# EAGLE design Printrboard-Pi-Link (EAGLE 7.1.0)
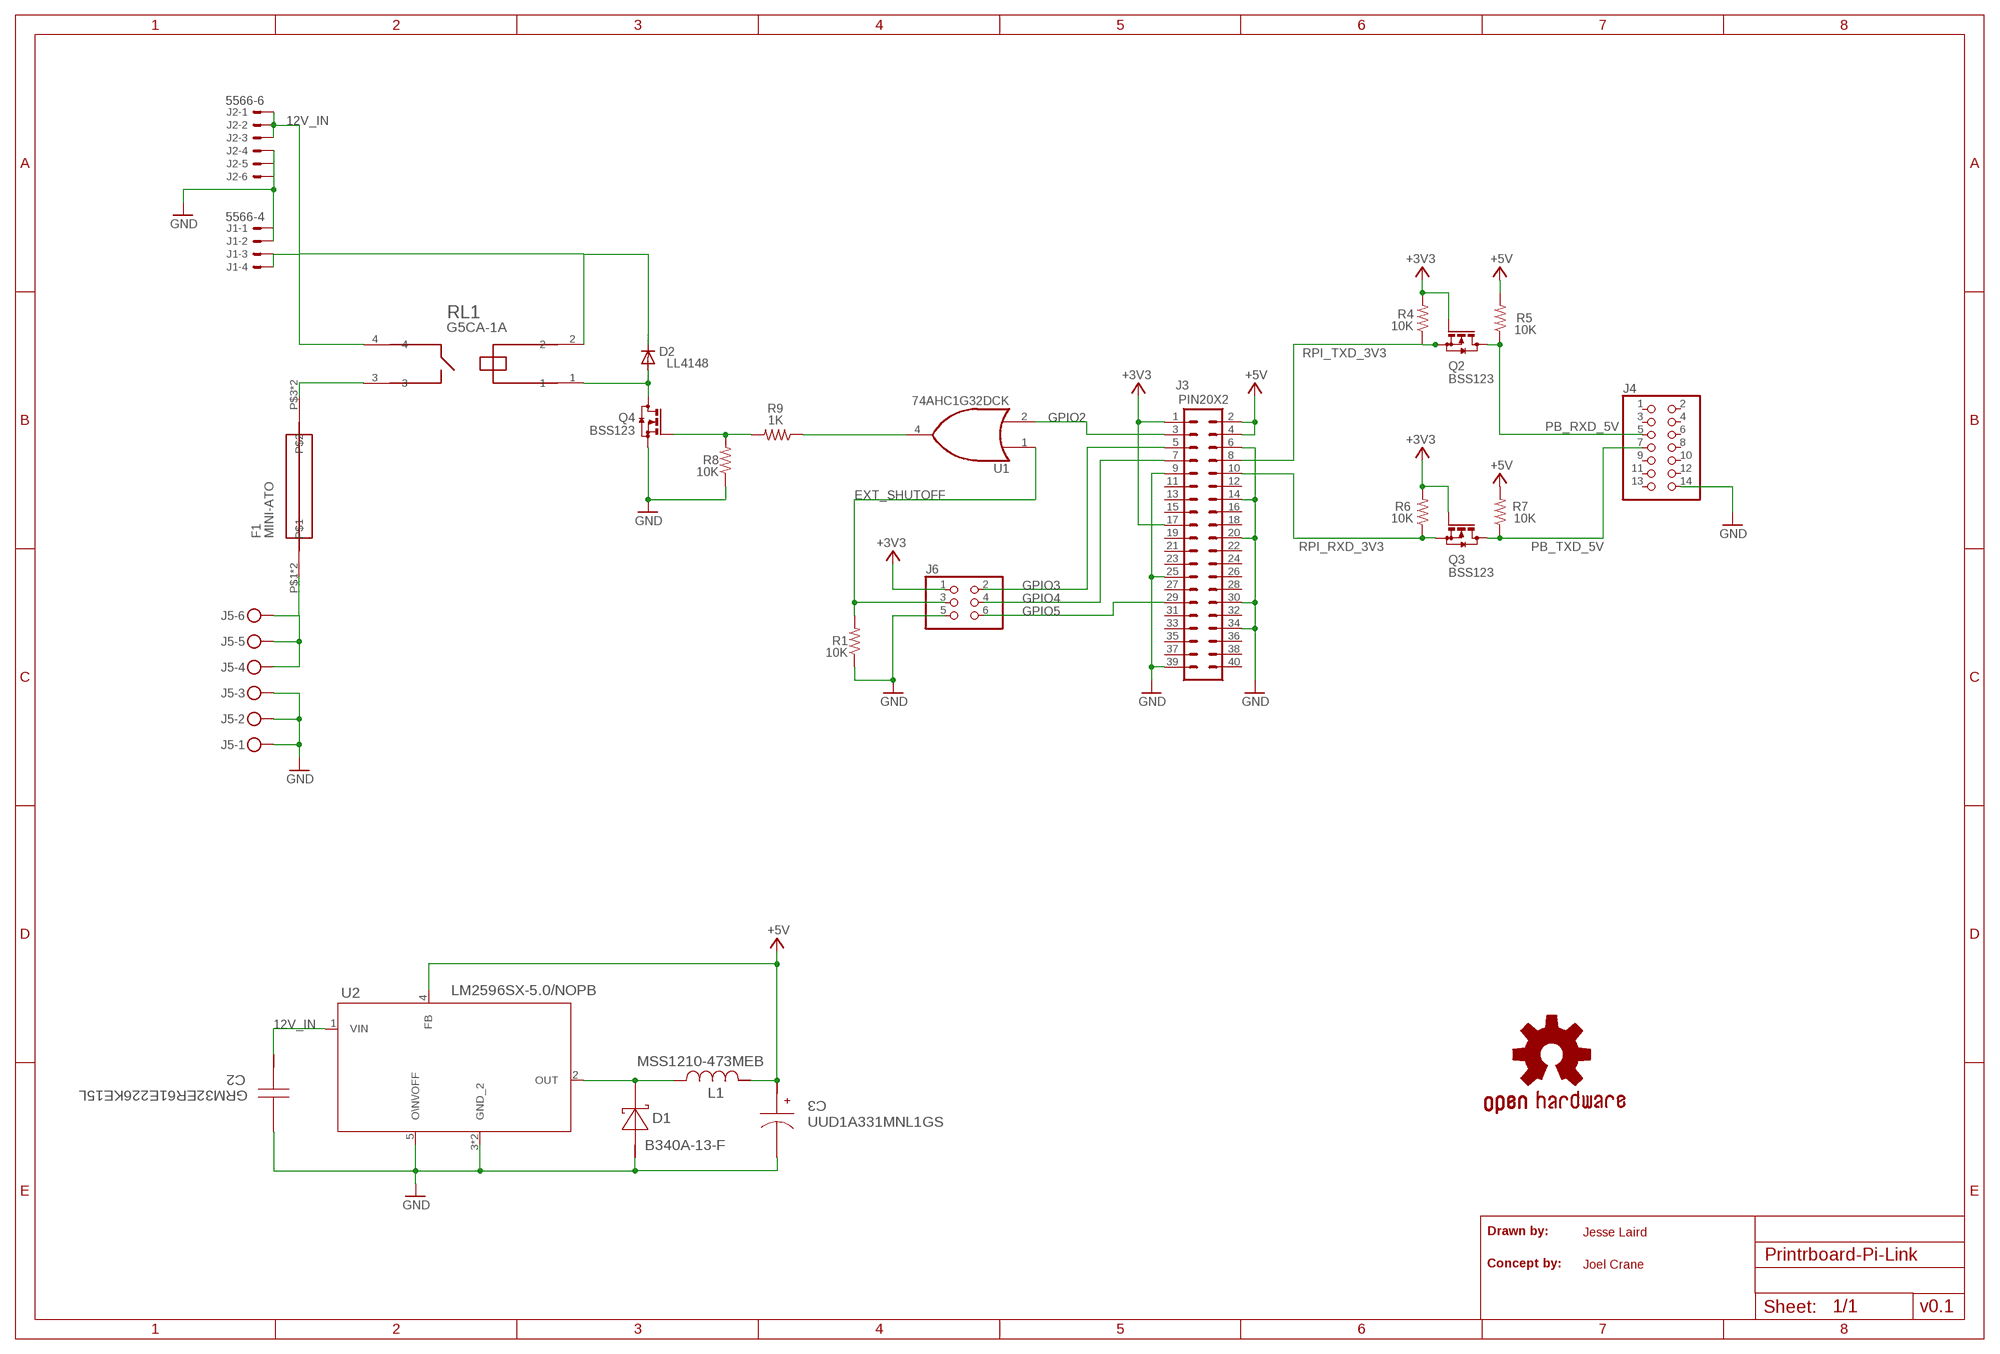
[diagram p0: schematic, sheet 1]

## Parts
C2  GRM32ER61E226KE15L  [1210]
C3  UUD1A331MNL1GS  [SM_RADIAL_8MM]
D1  B340A-13-F  [SMA]
D2  LL4148  PMLL4150  [SOD80C]
F1  MINI-ATO  [BK-6011]
GOLD_ORB_SM1  OSHWLOGO_GOLD_ORB_SM  [OSHW2]
J1  5566-4  [5566-4]
J2  5566-6  [5566-6]
J3  PIN20X2  [PIN_20X2]
J4  PINHD-2X7  [2X07]
J5  MKDSN1,5/6-5,08  [MKDSN1,5/6-5,08]
J6  PINHD-2X3  [2X03]
L1  MSS1210-473MEB  [MSS1210]
Q2  BSS123  [SOT23]
Q3  BSS123  [SOT23]
Q4  BSS123  [SOT23]
R1  10K  R-US_R0603  [R0603]
R4  10K  R-US_R0603  [R0603]
R5  10K  R-US_R0603  [R0603]
R6  10K  R-US_R0603  [R0603]
R7  10K  R-US_R0603  [R0603]
R8  10K  R-US_R0603  [R0603]
R9  1K  R-US_R0603  [R0603]
RL1  G5CA-1A  [G5CA]
U1  74AHC1G32DCK  [SC70-5]
U2  LM2596SX-5.0/NOPB  [TS5B]

## Nets
12V_IN: C2.1 D2.C J1.3 J1.4 J2.1 J2.2 J2.3 RL1.2 RL1.4 U2.1(VIN)
+3V3: J3.1 J3.17 J6.1 Q2.1(G) Q3.1(G) R4.2 R6.2
+5V: C3.1(+) J3.2 J3.4 L1.2 R5.2 R7.2 U2.4(FB)
EXT_SHUTOFF: J6.3 R1.2 U1.1(I0)
GND: C2.2 C3.2(-) D1.2(A) J1.1 J1.2 J2.4 J2.5 J2.6 J3.6 J3.9 J3.14 J3.20 J3.25 J3.30 J3.34 J3.39 J4.14 J5.1 J5.2 J5.3 J6.5 Q4.2(S) R1.1 R8.1 U2.3(GND_2) U2.5(O\N\/OFF) U2.6(GND_2)
GPIO2: J3.3 U1.2(I1)
GPIO3: J3.5 J6.2
GPIO4: J3.7 J6.4
GPIO5: J3.29 J6.6
N$2: F1.P$3 F1.P$4 RL1.3
N$3: R9.1 U1.4(O)
N$4: D1.1(K) L1.1 U2.2(OUT)
N$6: D2.A Q4.3(D) RL1.1
N$7: Q4.1(G) R8.2 R9.2
N$8: F1.P$1 F1.P$2 J5.4 J5.5 J5.6
PB_RXD_5V: J4.5 Q2.3(D) R5.1
PB_TXD_5V: J4.7 Q3.3(D) R7.1
RPI_RXD_3V3: J3.10 Q3.2(S) R6.1
RPI_TXD_3V3: J3.8 Q2.2(S) R4.1
Unconnected: J3.11 J3.12 J3.13 J3.15 J3.16 J3.18 J3.19 J3.21 J3.22 J3.23 J3.24 J3.26 J3.27 J3.28 J3.31 J3.32 J3.33 J3.35 J3.36 J3.37 J3.38 J3.40 J4.1 J4.2 J4.3 J4.4 J4.6 J4.8 J4.9 J4.10 J4.11 J4.12 J4.13

## Notes on the sheet
- Drawn by: | Jesse Laird
- Concept by: | Joel Crane
- v0.1

## Power pins joined to a net without a drawn wire
GND: U1.3(GND)
VCC: U1.5(VCC)

## Library data of the parts
C2 = jesse_laird:GRM32ER61E226KE15L; CAP: 2.2E-5; ESR: 0.0020; IRMS: 0.0; MANUFACTURER_NAME: MuRata; MANUFACTURER_PART_NUMBER: GRM32ER61E226KE15L; VDC: 25.0; VENDOR: MuRata
C3 = jesse_laird:UUD1A331MNL1GS; CAP: 3.3E-4; ESR: 0.17; IRMS: 0.45; MANUFACTURER_NAME: Nichicon; MANUFACTURER_PART_NUMBER: UUD1A331MNL1GS; VDC: 10.0; VENDOR: Nichicon
D1 = jesse_laird:B340A-13-F; DATASHEETURL: http://www.diodes.com/datasheets/ds30891.pdf; IO: 3.0; MANUFACTURER_NAME: Diodes Inc.; MANUFACTURER_PART_NUMBER: B340A-13-F; VENDOR: Diodes Inc.; VFATIO: 0.5; VRRM: 40.0
D2 = diode:PMLL4150: DIODE high speed
F1 = jesse_laird:MINI-ATO
GOLD_ORB_SM1 = bfl:OSHWLOGO: These are Open-Source Hardware logos.
J1 = con-molex:5566-4: Mini FIT connector 4 pol Source: http://www.molex.com; OC_FARNELL: unknown; OC_NEWARK: unknown
J2 = con-molex:5566-6: Mini FIT connector 6 pol Source: http://www.molex.com; MPN: 95566-61002; OC_FARNELL: unknown; OC_NEWARK: 22K8620
J3 = FLYFISH:PIN20X2
J4 = pinhead:PINHD-2X7: PIN HEADER
J5 = con-phoenix-508:MKDSN1,5/6-5,08: MKDSN 1,5/ 6-5,08 Printklemme Nennstrom: 13,5 A Nennspannung: 250 V Rastermaß: 5,08 mm Polzahl: 6 Anschlussart: Schraubanschluss Montage: Löten Anschlussrichtung Leiter/Platine: 0 ° Artikelnummer: 1729160 Source: http://eshop.phoenixcontact.com .. 1729160.pdf
J6 = pinhead:PINHD-2X3: PIN HEADER
L1 = jesse_laird:MSS1210-473MEB; DATASHEETURL: http://www.coilcraft.com/pdfs/mss1210.pdf; DCR: 0.051; DESCRIPTION: Unknown; IDC: 4.6; L: 4.7E-5; MANUFACTURER: CoilCraft; MANUFACTURER_NAME: Coilcraft; MANUFACTURER_PART_NUMBER: MSS1210-473MEB; PACKAGE_DESIGNATOR: MSS1210; VENDOR: Coilcraft
Q2-Q4 = transistor-small-signal:BSS123: N-CHANNEL MOS FET
R1 R4-R9 = resistor:R-US_: RESISTOR, American symbol
RL1 = jesse_laird:G5CA-1A
U1 = 74xx-little-us:74*1G32: 2-input OR gate
U2 = jesse_laird:LM2596SX-5.0/NOPB; DATASHEETURL: http://www.ti.com/product/lm2596; FREQUENCY: 150000.0; IMAX: 3.0; MANUFACTURER_NAME: Texas Instruments; MANUFACTURER_PART_NUMBER: LM2596SX-5.0/NOPB; MKTG_PACKAGE: NA; NSID: LM2596T-ADJ/NOPB; PACKAGE: NA; VENDOR: Texas Instruments

## Board
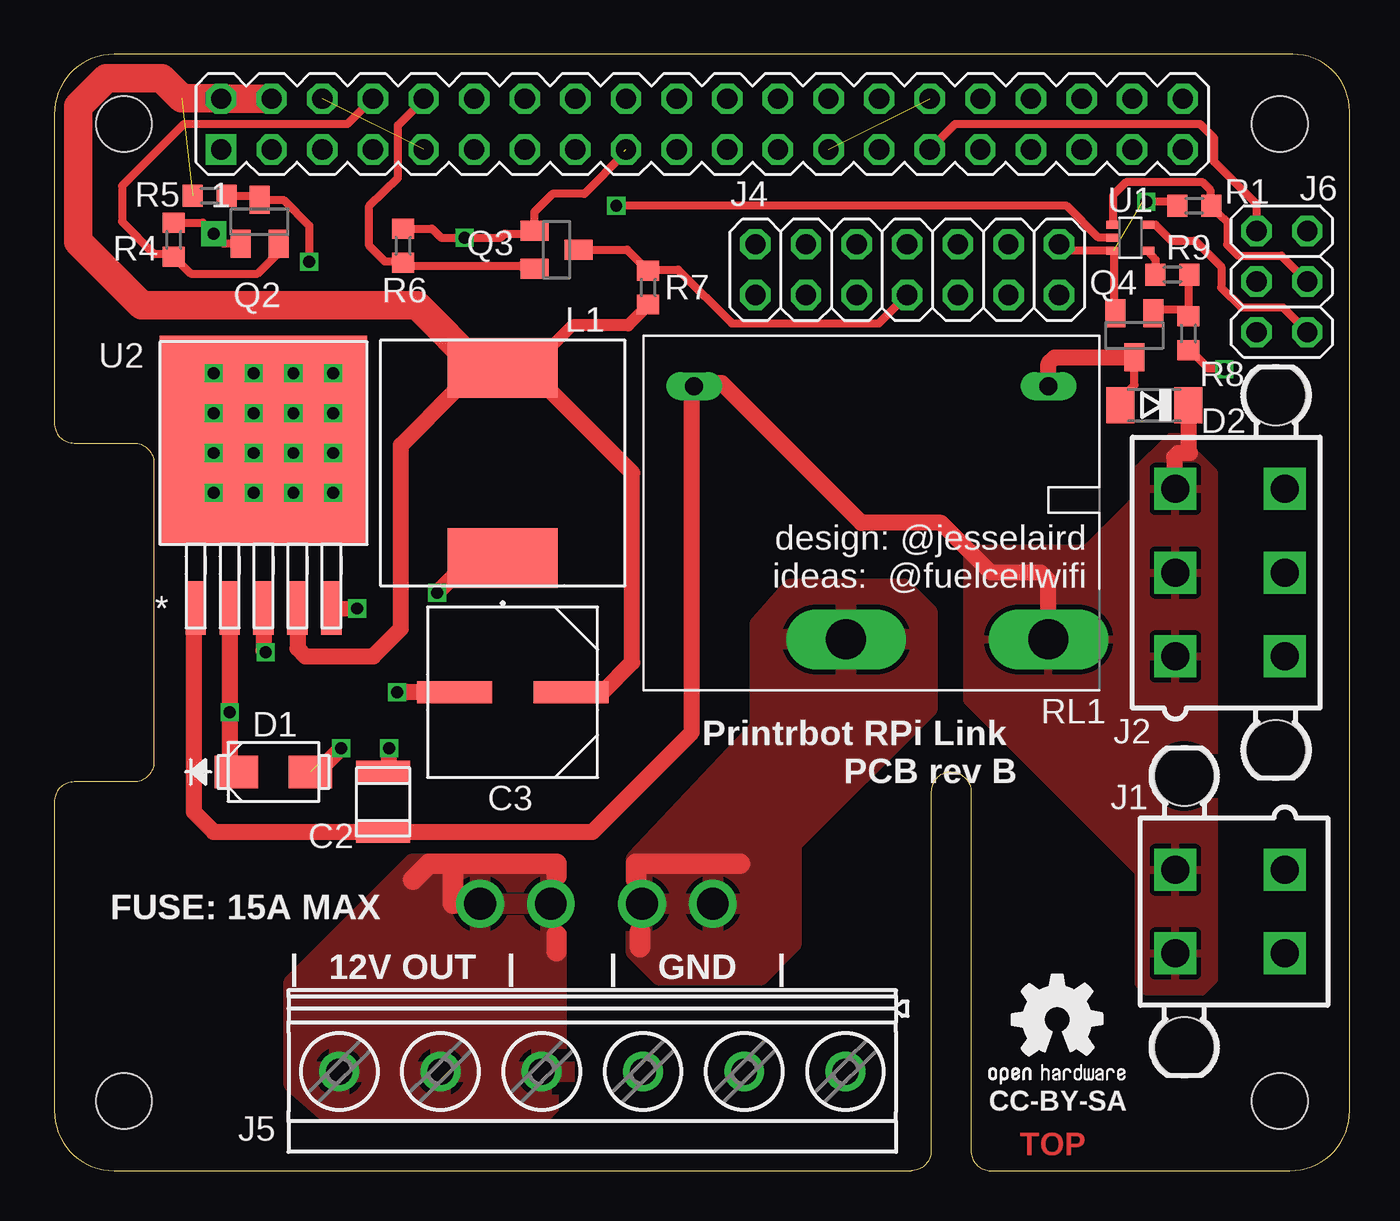
[diagram p1: board, top side]
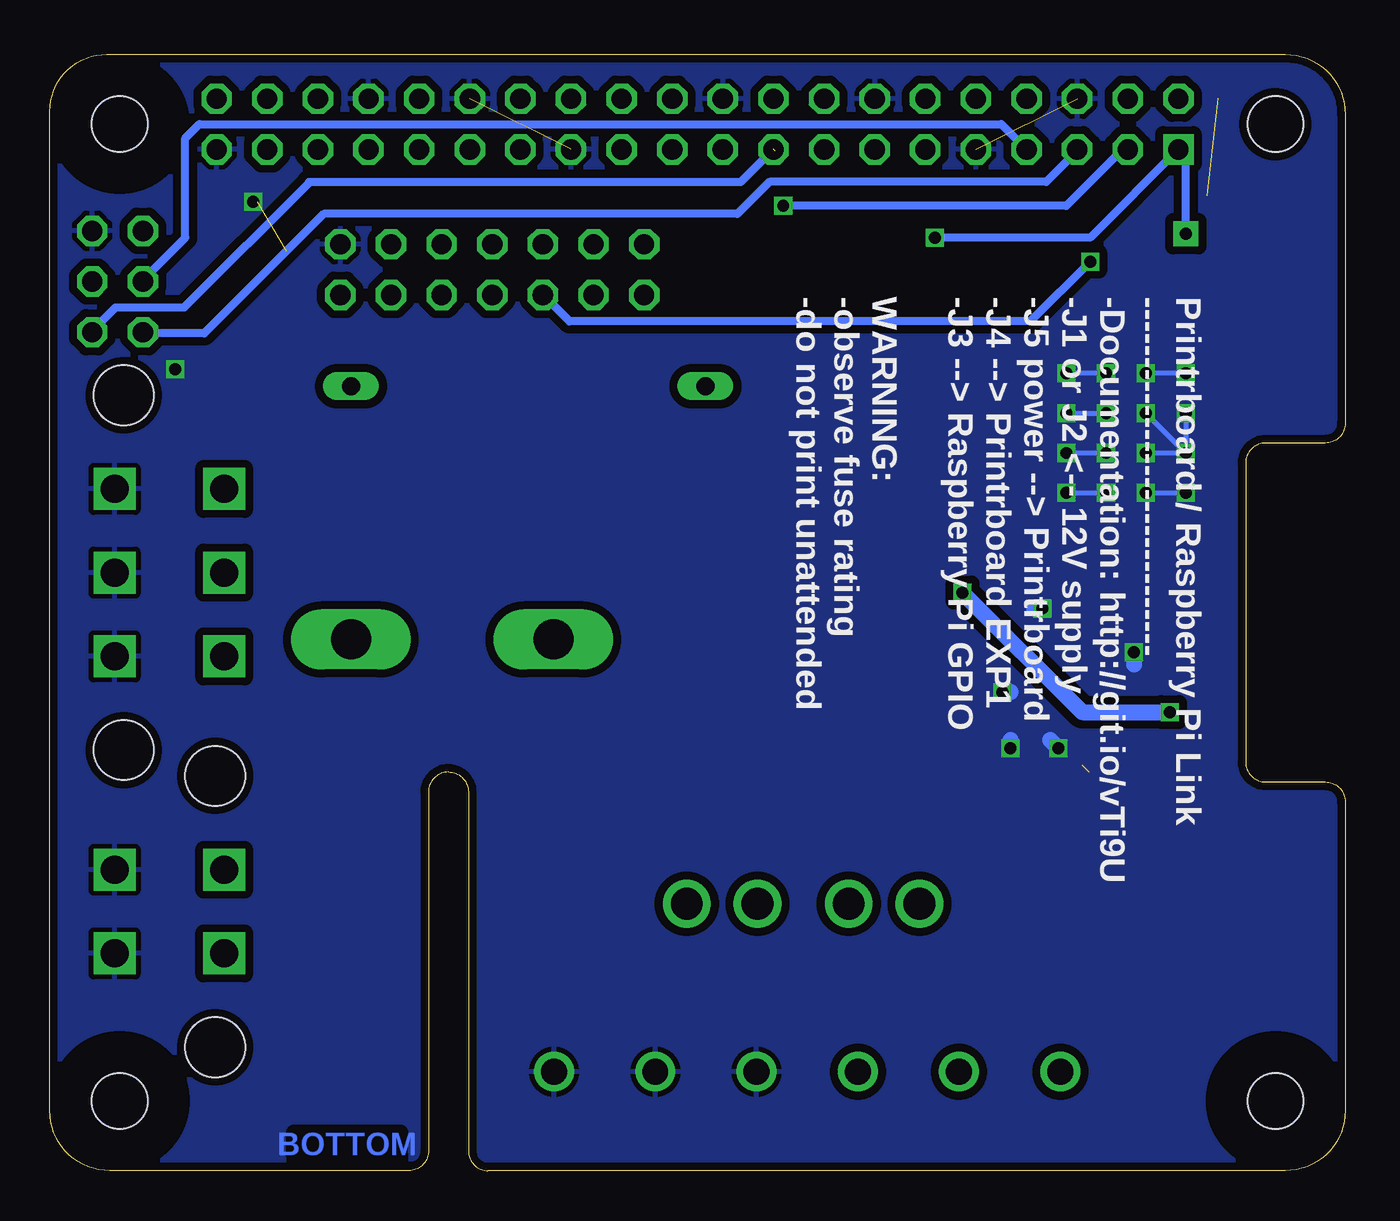
[diagram p2: board, bottom side, seen from below]

Size 65 x 56 mm. Coordinates in mm from the lower left corner, seen from the top.
Outline: 0,3 arc90 3,0 43,0 arc90 44,1 44,19 arc-90 45,20 arc-90 46,19 46,1 arc90 47,0 62,0 arc90 65,3 65,53.14 arc90 62.14,56 3,56 arc90 0,53 0,37.5 arc90 1,36.5 4,36.5 arc-90 5,35.5 5,20.5 arc-90 4,19.5 1,19.5 arc90 0,18.5 0,3
Copper layers (1*16): Top 0.035mm / dielectric 1.5mm / Bottom 0.035mm
Design rules "ITEADstudio_DRC": minimum track width 6mil, minimum drill 12mil, track to track 6mil, track to pad 6mil, pad to pad 6mil, via to via 6mil, smd to smd 0mil, copper to edge 10mil, drill to drill 10mil, minimum pad ring 10mil, minimum via ring 6mil, stop-mask expansion 2mil, vias tented up to drill 100mil, thermal gap 10mil
Holes 2.8 mm at 3.5,3.5 3.5,52.5 61.5,52.5 61.5,3.5
tRestrict: area 60,51 to 63,54; area 60,1.9 to 63,5; area 1.9,1.9 to 5,5
bRestrict: area 1.9,1.9 to 5,5; area 60,1.9 to 63,5; area 60,51 to 63,54

### Footprints (pad centres in the part's own frame; a part is rotated, then mirrored left to right if it is on the bottom)
1210 = smd 1.118 x 2.692: 1 -1.499,0; 2 1.499,0
SM_RADIAL_8MM = smd 3.759 x 1.092: 1 -2.921,0; 2 2.921,0
SMA = smd 2.184 x 1.626: 1 -1.854,0; 2 1.854,0
SOD80C = smd 1.4 x 1.8: A 1.7,0; C -1.7,0
BK-6011 = drill 1.6: P$1 -2.286,0; P$2 -5.842,0; P$3 2.286,0; P$4 5.842,0
5566-4 = drill 1.4 square: 1 2.1,-2.75; 2 -2.1,-2.75; 3 2.1,2.75; 4 -2.1,2.75 | hole 3: 6.8,2.29; -6.8,2.29
5566-6 = drill 1.4 square: 1 4.2,-2.75; 2 0,-2.75; 3 -4.2,-2.75; 4 4.2,2.75; 5 0,2.75; 6 -4.2,2.75 | hole 3: 8.9,2.29; -8.9,2.29
PIN_20X2 = drill 1.016 square: 1 -24.13,-1.27 | drill 1.016 octagon: 2 -24.13,1.27; 3 -21.59,-1.27; 4 -21.59,1.27; 5 -19.05,-1.27; 6 -19.05,1.27; 7 -16.51,-1.27; 8 -16.51,1.27; 9 -13.97,-1.27; 10 -13.97,1.27; 11 -11.43,-1.27; 12 -11.43,1.27; 13 -8.89,-1.27; 14 -8.89,1.27; 15 -6.35,-1.27; 16 -6.35,1.27; 17 -3.81,-1.27; 18 -3.81,1.27; 19 -1.27,-1.27; 20 -1.27,1.27; 21 1.27,-1.27; 22 1.27,1.27; 23 3.81,-1.27; 24 3.81,1.27; 25 6.35,-1.27; 26 6.35,1.27; 27 8.89,-1.27; 28 8.89,1.27; 29 11.43,-1.27; 30 11.43,1.27; 31 13.97,-1.27; 32 13.97,1.27; 33 16.51,-1.27; 34 16.51,1.27; 35 19.05,-1.27; 36 19.05,1.27; 37 21.59,-1.27; 38 21.59,1.27; 39 24.13,-1.27; 40 24.13,1.27
2X07 = drill 1.016 octagon: 1 -7.62,-1.27; 2 -7.62,1.27; 3 -5.08,-1.27; 4 -5.08,1.27; 5 -2.54,-1.27; 6 -2.54,1.27; 7 0,-1.27; 8 0,1.27; 9 2.54,-1.27; 10 2.54,1.27; 11 5.08,-1.27; 12 5.08,1.27; 13 7.62,-1.27; 14 7.62,1.27
MKDSN1,5/6-5,08 = drill 1.3 pad 2: 1 -12.7,0.025; 2 -7.62,0.025; 3 -2.54,0.025; 4 2.54,0.025; 5 7.62,0.025; 6 12.7,0.025
2X03 = drill 1.016 octagon: 1 -2.54,-1.27; 2 -2.54,1.27; 3 0,-1.27; 4 0,1.27; 5 2.54,-1.27; 6 2.54,1.27
MSS1210 = smd 2.997 x 5.512: 1 -4.763,0; 2 4.763,0
SOT23 = smd 1 x 1.4: 1 -0.95,-1.1; 2 0.95,-1.1; 3 0,1.1
R0603 = smd 1 x 1.1: 1 -0.85,0; 2 0.85,0
G5CA = drill 0.9 long: 1 8.89,6.35; 2 -8.89,6.35 | drill 2 long: 3 -1.27,-6.35; 4 8.89,-6.35
SC70-5 = smd 0.4 x 0.7: 1 -0.65,-0.85; 2 0,-0.85; 3 0.65,-0.85; 4 0.65,0.85; 5 -0.65,0.85
TS5B = smd 1.016 x 2.692: 1 -3.404,-8.28; 2 -1.702,-8.28; 3 0,-8.28; 4 1.702,-8.28; 5 3.404,-8.28 | smd 10.414 x 10.465: 6 0,0.152

### Placement (x,y rotation side)
C2  16.5,18.5 90 top
C3  23,24 180 top
D1  11,20 0 top
D2  55.2,38.4 180 top
F1  27.2,13.4 0 top
GOLD_ORB_SM1  46.5,3.3 0 top
J1  59,13 90 top
J2  59,30 270 top
J3  32.5,52.5 0 top
J4  42.8,45.2 0 top
J5  27,5 180 top
J6  61.6,44.6 90 top
L1  22.5,35.5 90 top
Q2  10.3,47.6 0 top
Q3  25.2,46.2 270 top
Q4  54.2,41.9 180 top
R1  57.2,48.4 0 top
R4  6,46.7 90 top
R5  7.8,48.9 180 top
R6  17.5,46.4 90 top
R7  29.8,44.3 270 top
R8  56.9,42 90 top
R9  56.1,44.95 0 top
RL1  41,33 0 top
U1  54,46.8 270 top
U2  10.5,36.5 0 top

### Tracks (layer width: path | path; a pad name or v marks a point on that pad's centre or on a via)
12V_IN
  Top 0.406: 32.26,39.2 RL1.2
  Top 0.813: U2.1 7,28.12 7,18 8,17 C2.1 27,17 32,22 32,39.24 RL1.2 32.26,39.5 33.5,39.5 40.5,32.5 44.5,32.5 47,30 49.5,30 49.89,29.61 49.89,27.51 | D2.C 56.9,36.1 57,36 56.4,36 56.2,35.8 56.2,34.25 J2.3
  pour Top: 45.8,31.2 45.8,23.6 54.4,15 54.4,9.4 54.8,9 57.6,9 58.2,9.6 58.2,35 56.4,36.8 56,36.8 54.2,35 54.2,33.6 51.8,31.2
+3V3  (via drill 0.6, 0.6 pad 1.27)  (1 unrouted)
  Top 0.406: R4.2 7.45,47.55 v8,47 8.5,46.5 Q2.1 | 28.6,51.14 28.6,51 26.6,49 25,49 24.1,48.1 Q3.1 23.85,47.4 23.85,47.25 23.6,47 22.6,47 22.4,46.8 v20.6,46.8 19.4,46.8 18.95,47.25 R6.2
  Bottom 0.406: v8,47 8,50.86 J3.1 12.8,46.8 v20.6,46.8 | J6.1 62.87,42.13 61.7,43.3 58.25,43.3 52,49.55 52,49.6 30.32,49.6 J3.17
+5V  (1 unrouted)
  Top 0.406: R5.2 6.95,48.75
  Top 0.61: R7.2 29.8,43.4 28.8,42.4 26,42.4 24.2,40.6 24.2,40.3 23.4,39.5
  Top 0.813: U2.4 12.2,26.2 12.6,25.8 16,25.8 17.4,27.2 17.4,36.4 20.2,39.2 20.27,39.2 21.34,40.26 | 24.8,24 C3.1 27.5,24 29,25.5 29,35 24.5,39.5 23.4,39.5 23.26,39.5 L1.2
  Top 1.422: L1.2 21.34,40.26 18.2,43.4 4.4,43.4 1.2,46.6 1.2,53.4 2.6,54.8 5.4,54.8 6.4,53.8 8.34,53.8 J3.2 J3.4
EXT_SHUTOFF
  Top 0.406: J6.3 61.57,45.9 59.4,45.9 58.85,46.45 58.85,47.6 58.05,48.35 R1.2 58,48.45 58,49.2 57.6,49.6 53.8,49.6 53.15,48.95 U1.1
GND  (via drill 0.6)  (4 unrouted)
  Top 0.254: U2.6 v8,40 | v10,40 v12,40 | v14,40 v14,38 | v12,38 v10,38 | v10,38 v8,38 | v10,38 v8,36 | v10,36 v12,36 | v14,36 v14,34 | v12,34 v10,34
  Top 0.406: Q4.2 53.25,43.35 53.2,43.4 53.2,46.1 U1.3 50.74,46.15 J4.14 | R1.1 56.35,48.45 56.2,48.6 v54.8,48.6 | R8.1 56.8,41.35 57.9,40.25 58.65,40.25 v58.7,40.2
  Top 0.813: U2.3 10.5,26.1 v10.6,26 | U2.5 v15.2,28.2 | C3.2 v17.2,24 | 13.23,20.37 13.57,20.37 v14.4,21.2 | C2.2 16.6,20 16.8,20.2 v16.8,21.2
  Bottom 0.254: v8,40 v10,40 | v12,40 v14,40 | v14,38 v12,38 | v8,38 v8,36 | v8,36 v10,38 | v8,36 v10,36 | v12,36 v14,36 | v14,34 v12,34 | v10,34 v8,34
  Bottom 0.406: v54.8,48.6 54.6,48.6 | v58.7,40.2 58.65,40.15
  Bottom 0.813: v10.6,26 10.6,25.4 | v15.2,28.2 15.6,28.2 | v17.2,24 16.8,24 | v14.4,21.2 14.8,21.6 | v16.8,21.2 16.8,21.6
  pour Bottom (isolate 0.406): 0,3 arc90 3,0 43,0 arc90 44,1 44,19 arc-90 45,20 arc-90 46,19 46,1 arc90 47,0 62,0 arc90 65,3 65,53 arc90 62,56 3,56 arc90 0,53 0,37.5 arc90 1,36.5 4,36.5 arc-90 5,35.5 5,20.5 arc-90 4,19.5 1,19.5 arc90 0,18.5
GPIO2  (via drill 0.6)
  Top 0.406: U1.2 52.4,46.8 50.8,48.4 v28.2,48.4
  Bottom 0.406: J3.3 11.17,51.23 14,48.4 v28.2,48.4
GPIO3
  Bottom 0.406: J3.5 13.45,51.15 15,49.6 28.9,49.6 30.5,48 51.25,48 57.25,42 60.25,42 60.19,42.06 J6.2
GPIO4
  Bottom 0.406: J6.4 60.33,44.67 58.2,46.8 58.2,51.8 57.5,52.5 17.26,52.5 J3.7
GPIO5
  Top 0.406: J6.6 60.33,48.47 58.2,50.6 58.2,51.8 57.5,52.5 45.2,52.5 J3.29
N$2
  Top 1.016: 29.2,14.6 29.2,15.4 34.4,15.4 | 29.4,12 29.4,11.2
  pour Top: 29.2,11 29.2,15.6 35.4,22.2 35.4,27.4 37,29.2 42.6,29.2 43.8,28 43.8,23.2 37,16.4 37,11.4 35.4,9.8 30.4,9.8
N$3
  Top 0.406: U1.4 55.25,45.7 R9.1
N$4  (via drill 0.6)
  Top 0.813: U2.2 v8.8,23 8.8,20.4 9.15,20.4 D1.1 | L1.1 20.94,30.74 v19.2,29
  Bottom 0.813: v19.2,29 13.2,23 v8.8,23
N$6
  Top 0.406: D2.A 53.5,38.7 54.2,39.4 Q4.3
  Top 0.813: RL1.1 49.89,40.49 50.2,40.8 Q4.3
N$7
  Top 0.406: R9.2 R8.2 56.75,43.2 55.4,43.2 55.2,43 Q4.1
N$8
  Top 1.016: 25.2,11 25.2,11.8 | 25.2,14.8 25.2,15.4 20,15.4 | 20,13.4 20,15.4 | 20,15.4 18.8,15.4 18,14.6
  pour Top: 25.2,15.4 25.2,6.4 25.6,6 25.6,4 24.6,3 13.6,3 12,4.4 12,9.4 18,15.4
N$9
  Top 0.406: 54.95,47.45 55.25,47.45 56.05,46.65 57.25,46.65 58.55,45.35 58.55,44.3 59.55,43.3 61.65,43.3 62.9,42.05
PB_RXD_5V  (via drill 0.6)
  Top 0.406: v12.8,45.6 12.8,47.4 11.5,48.7 Q2.3 10.1,48.9 R5.1
  Bottom 0.406: v12.8,45.6 15.8,42.6 38.93,42.6 J4.5
PB_TXD_5V
  Top 0.406: 42.8,44 J4.7 41.37,42.5 34,42.5 31.3,45.2 29.85,45.2 R7.1 28.75,46.2 Q3.3
RPI_RXD_3V3
  Top 0.406: 24.1,45.55 Q3.2 23.55,45.25 23.4,45.4 17.65,45.4 R6.1 17.45,45.6 16.6,45.6 15.8,46.4 15.8,48.4 17.25,49.8 17.25,52.45 18.53,53.73 J3.10
  Bottom 0.406: J3.10 18.63,53.77
RPI_TXD_3V3
  Top 0.406: J3.8 15.97,53.77 14.7,52.5 6.5,52.5 3.4,49.4 3.4,47.6 5,46 5.85,46 R4.1 6.85,45 10.2,45 11.25,46.05 Q2.2 | 11.25,46.35 Q2.2 | 11.25,45.95 Q2.2

### Text on the board
Top: TOP
Bottom: BOTTOM
tPlace: design: @jesselaird / ideas: @fuelcellwifi | Printrbot RPi Link / PCB rev B | FUSE: 15A MAX | | 12V OUT | | | GND | | CC-BY-SA
bPlace: Printrboard / Raspberry Pi Link / ------------------------------ / -Documentation: http://git.io/vTi9U / -J1 or J2 <-- 12V supply / -J5 power --> Printrboard / -J4 --> Printrboard EXP1 / -J3 --> Raspberry Pi GPIO / / WARNING: / -observe fuse rating / -do not print unattended